# Altium schematic sheet 06_SOM.SchDoc
size 420 x 297 mm; SheetNumber: 9; SheetTotal: 29
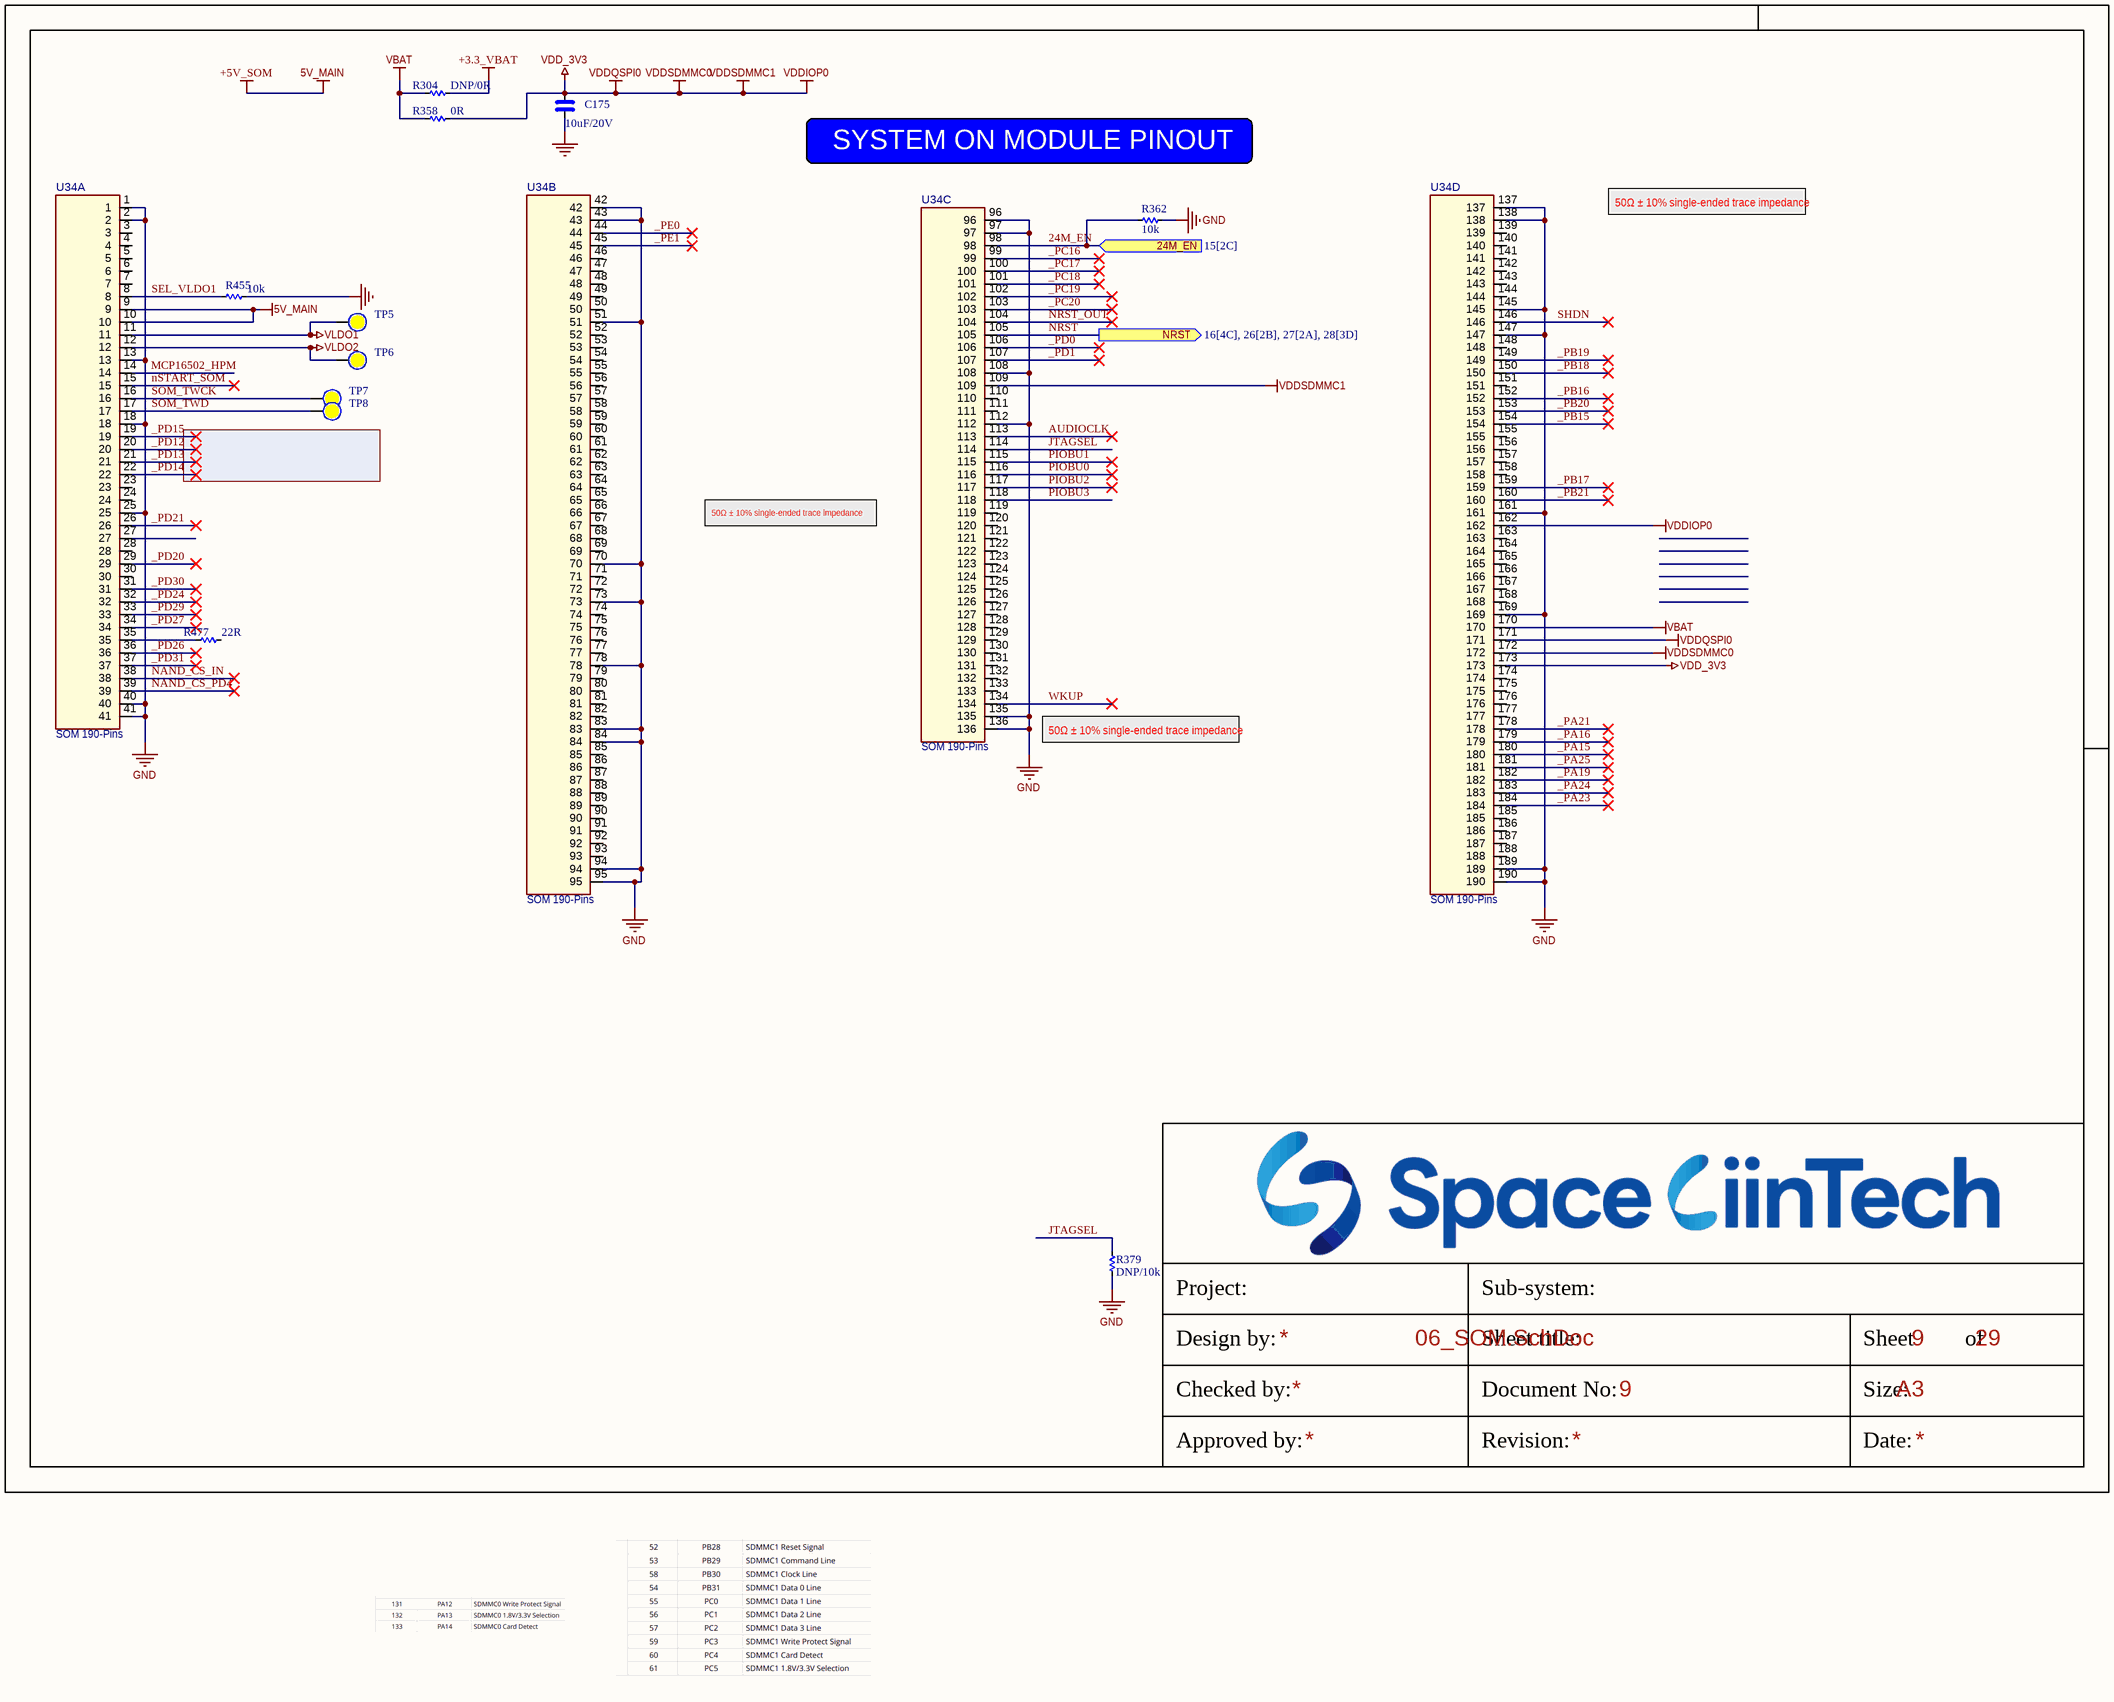
[diagram p0: 06_SOM.SchDoc]

## Parts
C175  10uF/20V  [CAP_C_2012X110]
R304  DNP/0R  [RES_C_1005X40]
R358  0R  [RES_C_1005X40]
R362  10k  [RES_C_1005X40]
R379  DNP/10k  [RES_C_1005X40]
R455  10k  [RES_C_1005X40]
R477  22R  [RES_C_1005X40]
TP5  (no value)  [Testpoint_TH_D130H80]  (no BOM)
TP6  (no value)  [Testpoint_TH_D130H80]  (no BOM)
TP7  (no value)  [Testpoint_TH_D130H80]  (no BOM)
TP8  (no value)  [Testpoint_TH_D130H80]  (no BOM)
U34  SOM 190-Pins  [SOM-38MMX30MM]  (parts A,B,C,D of 4)  (no BOM)

## Ports
24M_EN (in, see 15[2C]), NRST (out, see 16[4C], 26[2B], 27[2A], 28[3D])

## Nets
+3.3_VBAT: R304.1
+5V_SOM: U34.9 U34.10  [also labelled 5V_MAIN]
GND: C175.2 R362.1 R379.1 R455.1 U34.1 U34.2 U34.13 U34.18 U34.25 U34.40 U34.41 U34.42 U34.43 U34.51 U34.70 U34.73 U34.78 U34.83 U34.84 U34.94 U34.95 U34.96 U34.97 U34.108 U34.112 U34.135 U34.136 U34.137 U34.138 U34.145 U34.147 U34.161 U34.169 U34.189 U34.190
VBAT: R304.2 R358.2 U34.170
VDD_3V3: C175.1 R358.1 U34.109 U34.162 U34.171 U34.172 U34.173  [also labelled VDDIOP0, VDDQSPI0, VDDSDMMC0, VDDSDMMC1]
VLDO1: TP5.0 U34.11
VLDO2: TP6.0 U34.12
24M_EN: R362.2 U34.98 ; port 24M_EN
_PA15: U34.180
_PA16: U34.179
_PA19: U34.182
_PA21: U34.178
_PA23: U34.184
_PA24: U34.183
_PA25: U34.181
_PB15: U34.154
_PB16: U34.152
_PB17: U34.159
_PB18: U34.150
_PB19: U34.149
_PB20: U34.153
_PB21: U34.160
_PC16: U34.99
_PC17: U34.100
_PC18: U34.101
_PC19: U34.102
_PC20: U34.103
_PD0: U34.106
_PD1: U34.107
_PD12: U34.20
_PD13: U34.21
_PD14: U34.22
_PD15: U34.19
_PD20: U34.29
_PD21: U34.26
_PD24: U34.32
_PD26: U34.36
_PD27: U34.34
_PD29: U34.33
_PD30: U34.31
_PD31: U34.37
_PE0: U34.44
_PE1: U34.45
AUDIOCLK: U34.113
JTAGSEL: R379.2 U34.114
MCP16502_HPM: U34.14
NAND_CS_IN: U34.38
NAND_CS_PD4: U34.39
NRST: U34.105 ; port NRST
NRST_OUT: U34.104
nSTART_SOM: U34.15
PIOBU0: U34.116
PIOBU1: U34.115
PIOBU2: U34.117
PIOBU3: U34.118
SEL_VLDO1: R455.2 U34.8
SHDN: U34.146
SOM_TWCK: TP7.0 U34.16
SOM_TWD: TP8.0 U34.17
WKUP: U34.134
NetR477_2: R477.2 U34.35

Not connected (* = marked no-connect by the designer): R477 1; U34 3 4 5 6 7 23 24 27 28 30 46 47 48 49 50 52 53 54 55 56 57 58 59 60 61 62 63 64 65 66 67 68 69 71 72 74 75 76 77 79 80 81 82 85 86 87 88 89 90 91 92 93 110 111 119 120 121 122 123 124 125 126 127 128 129 130 131 132 133 139 140 141 142 143 144 148 151 155 156 157 158 163 164 165 166 167 168 174 175 176 177 185 186 187 188

## Notes on the sheet
- SYSTEM ON MODULE PINOUT
- 50Ω ± 10% single-ended trace impedance
- Project:
- Sub-system:
- Design by:
- Sheet title:
- Sheet
- of
- Checked by:
- Approved by:
- Revision:
- Document No:
- Size:
- Date:
- A3

## Library data of the parts
C175 = _CAP_C_High_2: CAP CHIP High Value
R304 R358 R362 R379 R455 R477 = _RES_B_2: RES
TP5-TP8 = Test Point: Solder: NF
U34 = SOM-190: 190-Castellated thru-holes, 38mm x 30mm package